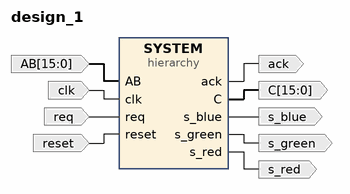
[diagram p0: block diagram of the top level]
# Vivado block design design_1, xc7a100tcsg324-1, Vivado 2021.1
create_bd_design design_1

create_bd_port -dir I -from 15 -to 0 AB
create_bd_port -dir O -from 15 -to 0 C
create_bd_port -dir O ack
create_bd_port -dir I -type clk clk
create_bd_port -dir I req
create_bd_port -dir I -type rst reset
create_bd_port -dir O s_blue
create_bd_port -dir O s_green
create_bd_port -dir O s_red

create_bd_cell -type hier SYSTEM

# ---- hierarchy /SYSTEM ----
current_bd_instance /SYSTEM
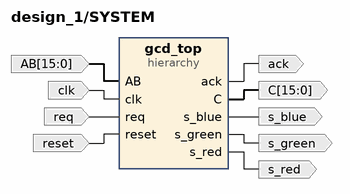
[diagram p1: block diagram inside /SYSTEM]
create_bd_pin -dir I -type clk clk
create_bd_pin -dir I -type rst reset
create_bd_pin -dir I req
create_bd_pin -dir I -from 15 -to 0 AB
create_bd_pin -dir O ack
create_bd_pin -dir O s_blue
create_bd_pin -dir O s_green
create_bd_pin -dir O s_red
create_bd_pin -dir O -from 15 -to 0 C

create_bd_cell -type hier gcd_top

# ---- hierarchy /SYSTEM/gcd_top ----
current_bd_instance /SYSTEM/gcd_top
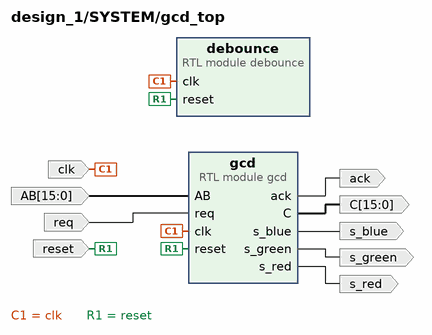
[diagram p2: block diagram inside /SYSTEM/gcd_top]
create_bd_pin -dir I -type clk clk
create_bd_pin -dir I -type rst reset
create_bd_pin -dir I req
create_bd_pin -dir I -from 15 -to 0 AB
create_bd_pin -dir O ack
create_bd_pin -dir O s_blue
create_bd_pin -dir O s_green
create_bd_pin -dir O s_red
create_bd_pin -dir O -from 15 -to 0 C

create_bd_cell -type module -reference debounce debounce
create_bd_cell -type module -reference gcd gcd

# ---- connections ----

current_bd_instance /SYSTEM
connect_bd_net -net AB_0_1 [get_bd_pins AB] [get_bd_pins gcd_top/AB]
connect_bd_net -net clk_0_1 [get_bd_pins clk] [get_bd_pins gcd_top/clk]
connect_bd_net -net gcd_top_0_C [get_bd_pins gcd_top/C] [get_bd_pins C]
connect_bd_net -net gcd_top_0_ack [get_bd_pins gcd_top/ack] [get_bd_pins ack]
connect_bd_net -net gcd_top_0_s_blue [get_bd_pins gcd_top/s_blue] [get_bd_pins s_blue]
connect_bd_net -net gcd_top_0_s_green [get_bd_pins gcd_top/s_green] [get_bd_pins s_green]
connect_bd_net -net gcd_top_0_s_red [get_bd_pins gcd_top/s_red] [get_bd_pins s_red]
connect_bd_net -net req_0_1 [get_bd_pins req] [get_bd_pins gcd_top/req]
connect_bd_net -net reset_0_1 [get_bd_pins reset] [get_bd_pins gcd_top/reset]

current_bd_instance /SYSTEM/gcd_top
connect_bd_net [get_bd_pins AB] [get_bd_pins gcd/AB]
connect_bd_net [get_bd_pins clk] [get_bd_pins debounce/clk] [get_bd_pins gcd/clk]
connect_bd_net -net gcd_0_C [get_bd_pins gcd/C] [get_bd_pins C]
connect_bd_net -net gcd_0_ack [get_bd_pins gcd/ack] [get_bd_pins ack]
connect_bd_net -net gcd_0_s_blue [get_bd_pins gcd/s_blue] [get_bd_pins s_blue]
connect_bd_net -net gcd_0_s_green [get_bd_pins gcd/s_green] [get_bd_pins s_green]
connect_bd_net -net gcd_0_s_red [get_bd_pins gcd/s_red] [get_bd_pins s_red]
connect_bd_net [get_bd_pins req] [get_bd_pins gcd/req]
connect_bd_net [get_bd_pins reset] [get_bd_pins debounce/reset] [get_bd_pins gcd/reset]

current_bd_instance /
connect_bd_net [get_bd_ports AB] [get_bd_pins SYSTEM/AB]
connect_bd_net [get_bd_ports clk] [get_bd_pins SYSTEM/clk]
connect_bd_net -net gcd_top_0_C [get_bd_pins SYSTEM/C] [get_bd_ports C]
connect_bd_net -net gcd_top_0_ack [get_bd_pins SYSTEM/ack] [get_bd_ports ack]
connect_bd_net -net gcd_top_0_s_blue [get_bd_pins SYSTEM/s_blue] [get_bd_ports s_blue]
connect_bd_net -net gcd_top_0_s_green [get_bd_pins SYSTEM/s_green] [get_bd_ports s_green]
connect_bd_net -net gcd_top_0_s_red [get_bd_pins SYSTEM/s_red] [get_bd_ports s_red]
connect_bd_net [get_bd_ports req] [get_bd_pins SYSTEM/req]
connect_bd_net [get_bd_ports reset] [get_bd_pins SYSTEM/reset]

validate_bd_design
save_bd_design
